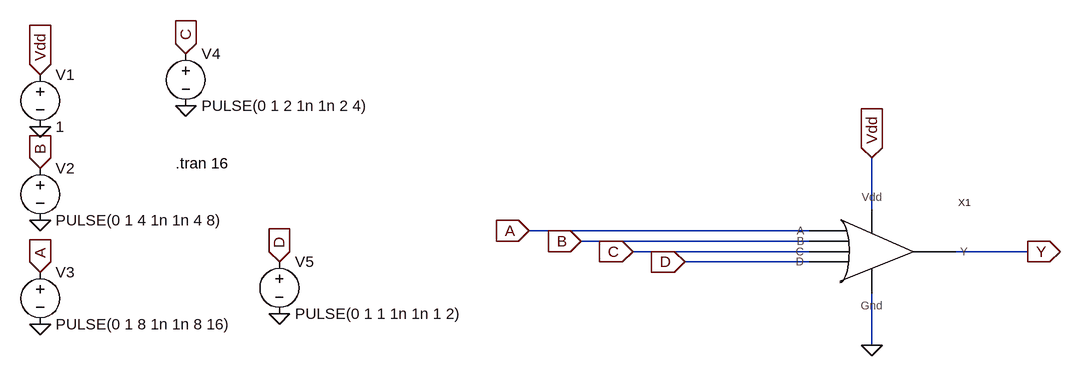
[diagram p0: schematic 4i_OR_Test.asc]
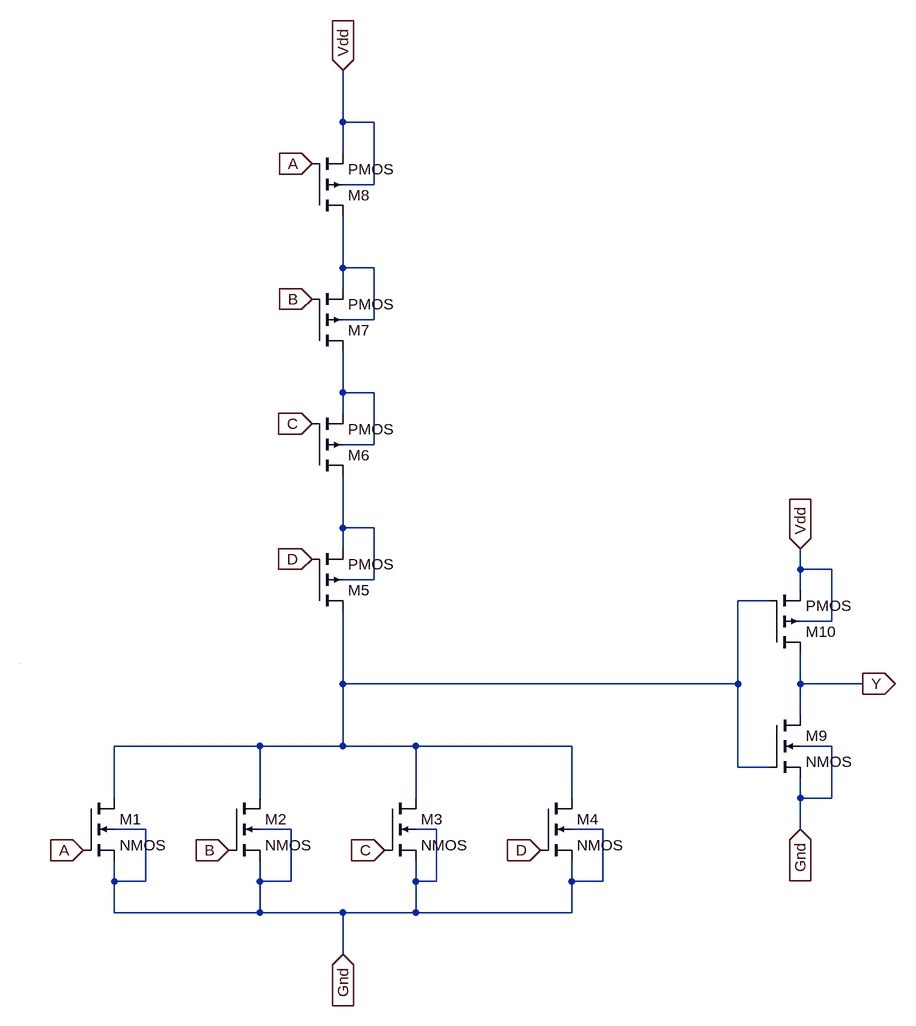
[diagram p1: sub-circuit 4i_or.asc]
4i_OR_Test.asc, the LTspice schematic file:
Version 4
SHEET 1 1260 680
WIRE 944 144 944 64
WIRE 848 176 416 176
WIRE 848 192 496 192
WIRE 848 208 576 208
WIRE 1184 208 1072 208
WIRE 848 224 656 224
WIRE 944 352 944 272
FLAG -336 -64 Vdd
IOPIN -336 -64 In
FLAG -336 80 B
IOPIN -336 80 In
FLAG -336 240 A
IOPIN -336 240 In
FLAG -336 16 0
FLAG -336 160 0
FLAG -336 320 0
FLAG -112 -96 C
IOPIN -112 -96 In
FLAG -112 -16 0
FLAG 32 224 D
IOPIN 32 224 In
FLAG 32 304 0
FLAG 416 176 A
IOPIN 416 176 In
FLAG 496 192 B
IOPIN 496 192 In
FLAG 576 208 C
IOPIN 576 208 In
FLAG 656 224 D
IOPIN 656 224 In
FLAG 944 64 Vdd
IOPIN 944 64 In
FLAG 1184 208 Y
IOPIN 1184 208 Out
FLAG 944 352 0
SYMBOL 4i_OR 976 224 R0
SYMATTR InstName X1
SYMBOL voltage -336 -80 R0
SYMATTR InstName V1
SYMATTR Value 1
SYMBOL voltage -336 64 R0
WINDOW 123 0 0 Left 0
WINDOW 39 0 0 Left 0
SYMATTR InstName V2
SYMATTR Value PULSE(0 1 4 1n 1n 4 8)
SYMBOL voltage -336 224 R0
WINDOW 123 0 0 Left 0
WINDOW 39 0 0 Left 0
SYMATTR InstName V3
SYMATTR Value PULSE(0 1 8 1n 1n 8 16)
SYMBOL voltage -112 -112 R0
WINDOW 123 0 0 Left 0
WINDOW 39 0 0 Left 0
SYMATTR InstName V4
SYMATTR Value PULSE(0 1 2 1n 1n 2 4)
SYMBOL voltage 32 208 R0
WINDOW 123 0 0 Left 0
WINDOW 39 0 0 Left 0
SYMATTR InstName V5
SYMATTR Value PULSE(0 1 1 1n 1n 1 2)
TEXT -128 72 Left 2 !.tran 16

4i_or.asc, the sub-circuit schematic file:
Version 4
SHEET 1 1372 680
WIRE 496 -832 496 -912
WIRE 544 -832 496 -832
WIRE 496 -784 496 -832
WIRE 544 -736 544 -832
WIRE 544 -736 496 -736
WIRE 496 -608 496 -688
WIRE 544 -608 496 -608
WIRE 496 -576 496 -608
WIRE 544 -528 544 -608
WIRE 544 -528 496 -528
WIRE 496 -416 496 -480
WIRE 544 -416 496 -416
WIRE 496 -384 496 -416
WIRE 544 -336 544 -416
WIRE 544 -336 496 -336
WIRE 496 -208 496 -288
WIRE 544 -208 496 -208
WIRE 496 -176 496 -208
WIRE 1200 -144 1200 -176
WIRE 1248 -144 1200 -144
WIRE 544 -128 544 -208
WIRE 544 -128 496 -128
WIRE 1200 -112 1200 -144
WIRE 1152 -96 1104 -96
WIRE 1248 -64 1248 -144
WIRE 1248 -64 1200 -64
WIRE 496 32 496 -80
WIRE 1104 32 1104 -96
WIRE 1104 32 496 32
WIRE 1200 32 1200 -16
WIRE 1296 32 1200 32
WIRE 1200 80 1200 32
WIRE 368 128 144 128
WIRE 496 128 496 32
WIRE 496 128 368 128
WIRE 608 128 496 128
WIRE 848 128 608 128
WIRE 1248 128 1200 128
WIRE 1104 160 1104 32
WIRE 1152 160 1104 160
WIRE 144 208 144 128
WIRE 368 208 368 128
WIRE 608 208 608 128
WIRE 848 208 848 128
WIRE 1200 208 1200 176
WIRE 1248 208 1248 128
WIRE 1248 208 1200 208
WIRE 192 256 144 256
WIRE 416 256 368 256
WIRE 640 256 608 256
WIRE 896 256 848 256
WIRE 1200 256 1200 208
WIRE 144 336 144 304
WIRE 192 336 192 256
WIRE 192 336 144 336
WIRE 368 336 368 304
WIRE 416 336 416 256
WIRE 416 336 368 336
WIRE 608 336 608 304
WIRE 640 336 640 256
WIRE 640 336 608 336
WIRE 848 336 848 304
WIRE 896 336 896 256
WIRE 896 336 848 336
WIRE 144 384 144 336
WIRE 368 384 368 336
WIRE 368 384 144 384
WIRE 496 384 368 384
WIRE 608 384 608 336
WIRE 608 384 496 384
WIRE 848 384 848 336
WIRE 848 384 608 384
WIRE 496 448 496 384
WIRE 0 0 0 0
FLAG 496 -912 Vdd
IOPIN 496 -912 In
FLAG 448 -768 A
IOPIN 448 -768 In
FLAG 448 -560 B
IOPIN 448 -560 In
FLAG 448 -368 C
IOPIN 448 -368 In
FLAG 448 -160 D
IOPIN 448 -160 In
FLAG 96 288 A
IOPIN 96 288 In
FLAG 320 288 B
IOPIN 320 288 In
FLAG 560 288 C
IOPIN 560 288 In
FLAG 800 288 D
IOPIN 800 288 In
FLAG 496 448 Gnd
IOPIN 496 448 In
FLAG 1200 -176 Vdd
IOPIN 1200 -176 In
FLAG 1200 256 Gnd
IOPIN 1200 256 In
FLAG 1296 32 Y
IOPIN 1296 32 Out
SYMBOL nmos4 96 208 R0
SYMATTR InstName M1
SYMBOL nmos4 320 208 R0
SYMATTR InstName M2
SYMBOL nmos4 560 208 R0
SYMATTR InstName M3
SYMBOL nmos4 800 208 R0
SYMATTR InstName M4
SYMBOL pmos4 448 -80 M180
SYMATTR InstName M5
SYMBOL pmos4 448 -288 M180
SYMATTR InstName M6
SYMBOL pmos4 448 -480 M180
SYMATTR InstName M7
SYMBOL pmos4 448 -688 M180
SYMATTR InstName M8
SYMBOL nmos4 1152 80 R0
SYMATTR InstName M9
SYMBOL pmos4 1152 -16 M180
SYMATTR InstName M10

The netlist it stands for:
* 4i_OR_Test.asc
XX1 A B C D Vdd 0 Y 4i_or
V1 Vdd 0 1
V2 B 0 PULSE(0 1 4 1n 1n 4 8)
V3 A 0 PULSE(0 1 8 1n 1n 8 16)
V4 C 0 PULSE(0 1 2 1n 1n 2 4)
V5 D 0 PULSE(0 1 1 1n 1n 1 2)

* block symbol definitions
.subckt 4i_or A B C D Vdd Gnd Y
M1 N004 A Gnd Gnd NMOS
M2 N004 B Gnd Gnd NMOS
M3 N004 C Gnd Gnd NMOS
M4 N004 D Gnd Gnd NMOS
M5 N004 D N003 N003 PMOS
M6 N003 C N002 N002 PMOS
M7 N002 B N001 N001 PMOS
M8 N001 A Vdd Vdd PMOS
M9 Y N004 Gnd Gnd NMOS
M10 Y N004 Vdd Vdd PMOS
.ends 4i_or

.model NMOS NMOS
.model PMOS PMOS
.lib standard.mos
.tran 16
.backanno
.end

* Results of the author's LTspice run, read from the files saved beside the schematic
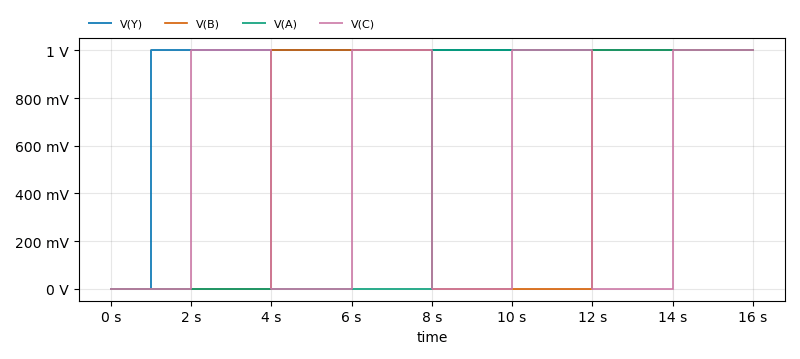
[diagram p2: Transient Analysis of 4i_OR_Test.asc, plotted from the saved traces]
* Transient Analysis, 1 run:
*   V(Y): min 100.5 nV, max 1 V, average 937.5 mV, rms 968.2 mV, last 1 V
*   V(B): min 0 V, max 1 V, average 500 mV, rms 707.1 mV, last 1 V
*   V(A): min 0 V, max 1 V, average 500 mV, rms 707.1 mV, last 1 V
*   V(C): min 0 V, max 1 V, average 500 mV, rms 707.1 mV, last 1 V